# Altium project NFC-BOARD-TAG.PrjPcb
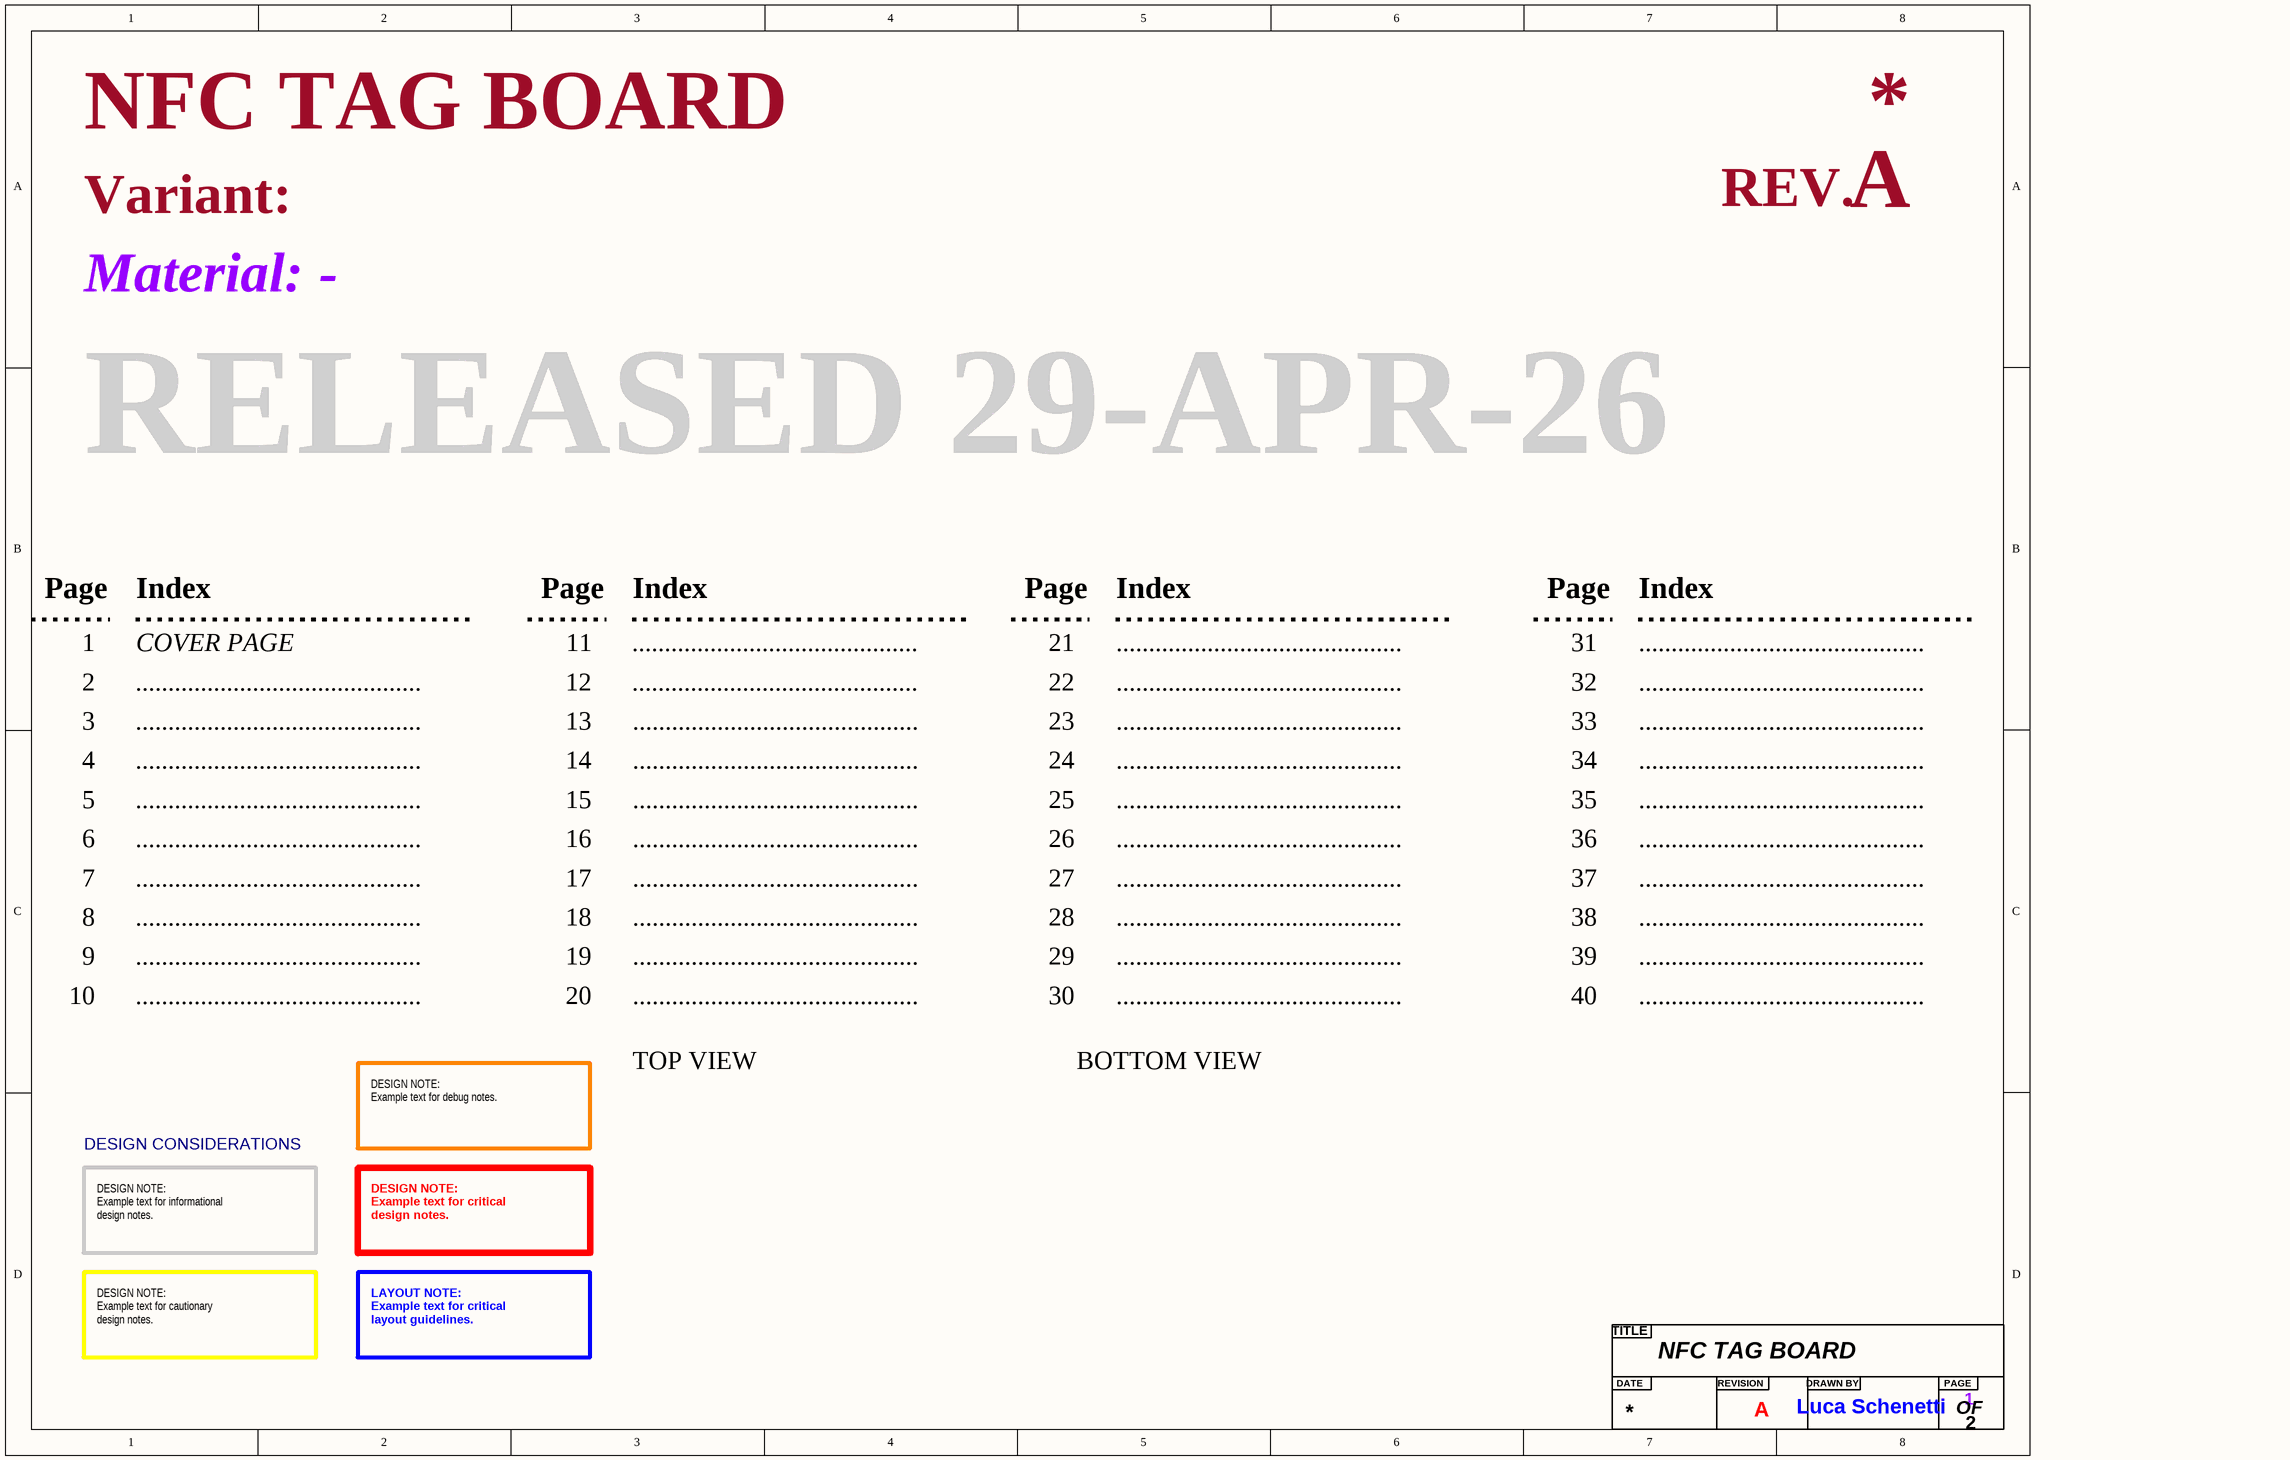
[diagram p0: COVER PAGE.SchDoc]
2 sheets, 7 parts. Net scope: global (net labels, ports and power ports of the same name join across sheets).
Board file: LAYOUT-PCB.PcbDoc
Sheets:
  COVER PAGE.SchDoc
  BOARD.SchDoc

## Sheet COVER PAGE.SchDoc: NFC TAG BOARD
size A3; Author: Luca Schenetti; DrawnBy: Luca Schenetti; Revision: A; SheetNumber: 1; SheetTotal: 2; Material: -

### Parts
(Parts that share a designator on the sheet are numbered #1, #2 ... from top to bottom, then left to right.)
?#1  Title  (value not drawn)  (graphical)

### Notes on the sheet
- Variant:
- REV.
- Material:
- RELEASED 29-APR-26
- Page
- Index
- 1
- 2
- COVER PAGE
- ............................................
- 11
- 12
- 21
- 22
- 31
- 32
- 3
- 13
- 23
- 33
- 4
- 5
- 14
- 15
- 24
- 25
- 34
- 35
- 6
- 7
- 16
- 17
- 26
- 27
- 36
- 37
- 8
- 18
- 28
- 38
- 9
- 10
- 19
- 20
- 29
- 30
- 39
- 40
- TOP VIEW
- BOTTOM VIEW
- DESIGN CONSIDERATIONS
- DESIGN NOTE:
  Example text for debug notes.
- DESIGN NOTE:
  Example text for informational
  design notes.
- DESIGN NOTE:
  Example text for critical
  design notes.
- DESIGN NOTE:
  Example text for cautionary
  design notes.
- LAYOUT NOTE:
  Example text for critical
  layout guidelines.
- (in symbol Title) TITLE; DATE; REVISION; DRAWN BY; PAGE; OF

## Sheet BOARD.SchDoc: NFC TAG BOARD
size A4; DrawnBy: Luca Schenetti; Revision: A; SheetNumber: 2; SheetTotal: 2
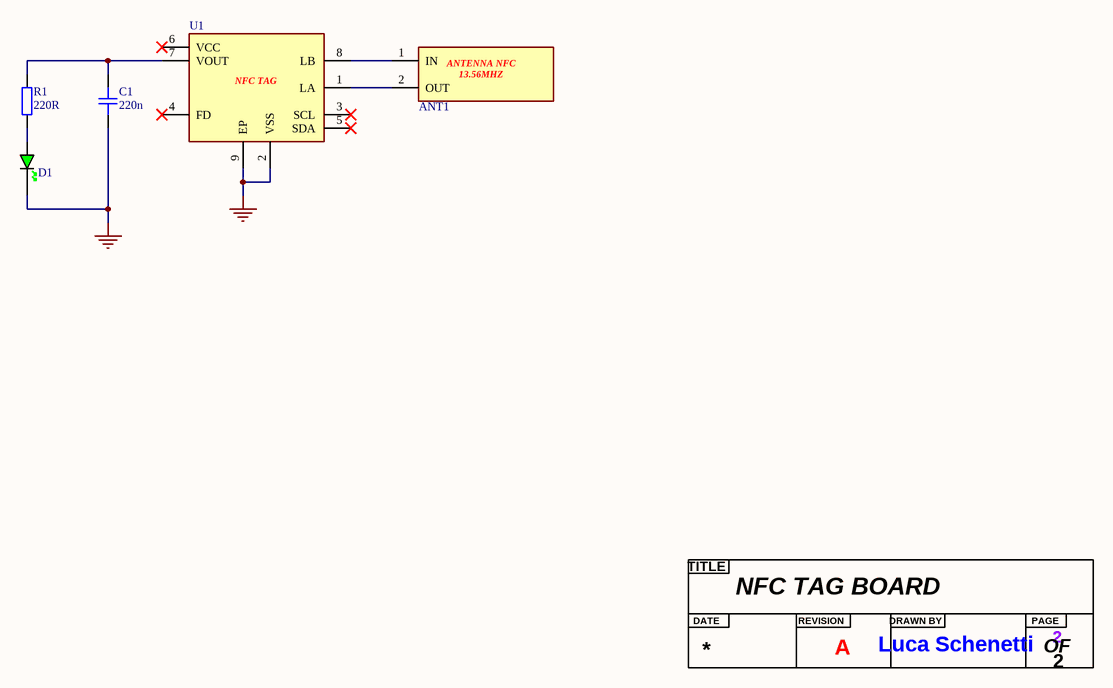
[diagram p1: BOARD.SchDoc]

### Parts
(Parts that share a designator on the sheet are numbered #1, #2 ... from top to bottom, then left to right.)
?#2  Title  (value not drawn)  (graphical)
ANT1  ANTENNA NFC 13.56 MHZ 2  [ANTENNA NFC 13.56 MHZ 2]  (value not drawn)  (no BOM)
C1  220n  [CAP_0402]
D1  GREEN  [LED_0603_GREEN]  (value not drawn)
R1  220R  [RES_0402]
U1  NFC TAG 13.56MHz  [NT3H1101W0FHKH]  (value not drawn)

### Nets
GND: C1.1 D1.K U1.2(VSS) U1.9(EP)
NetANT1_1: ANT1.1(IN) U1.8(LB)
NetANT1_2: ANT1.2(OUT) U1.1(LA)
NetC1_2: C1.2 R1.2 U1.7(VOUT)
NetD1_A: D1.A R1.1

Not connected (* = marked no-connect by the designer): U1 3(SCL)* 4(FD)* 5(SDA)* 6(VCC)*

### Notes on the sheet
- (in symbol ANTENNA NFC 13.56 MHZ 2) ANTENNA NFC; 13.56MHZ
- (in symbol NT3H1101W0FHKH) NFC TAG
- (in symbol Title) TITLE; DATE; REVISION; DRAWN BY; PAGE; OF

### Library data of the parts
ANT1 = ANTENNA NFC 13.56 MHZ 2: ANTENNA NFC 13.56 MHZ
C1 = CAP_0402: [C16772]; Manufacturer: *; Manufacturer Part Number: *; Distributor Link: *; LCSC: *; Rating: *; Dielectric: *
D1 = LED_0603_GREEN: [C2986059]
R1 = RES_0402: [C25091]; Manufacturer: *; Manufacturer Part Number: *; Distributor Link: *; LCSC: *
U1 = NT3H1101W0FHKH: [C73156]